# Altium schematic sheet FOTA MicroController Power Switch.SchDoc: FOTA MicroController Latched Power Trigger
size A4; DocumentNumber: 44; SheetNumber: 44; SheetTotal: 54
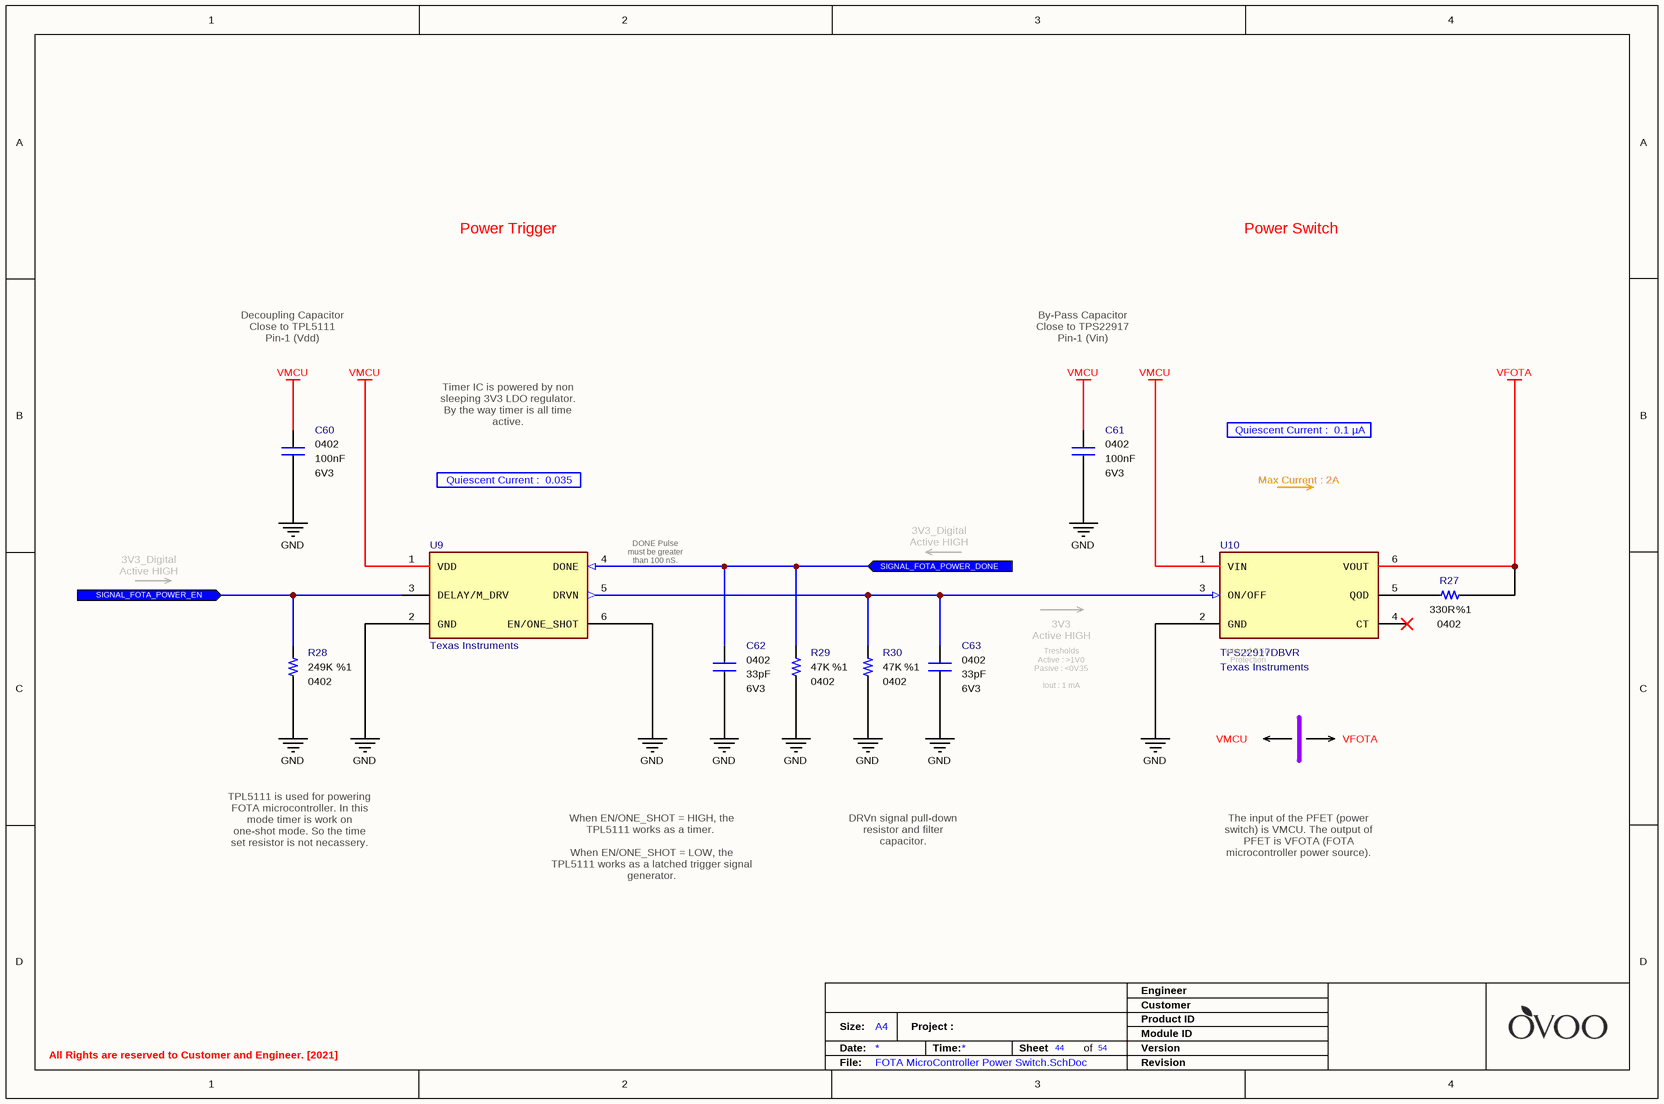
[diagram p0: FOTA MicroController Power Switch.SchDoc]

## Parts
C60  value 100nF  Case: 0402  Voltage: 6V3  [CAPACITOR_0402]  (hidden comment: Multilayer Ceramic Capacitor)
C61  value 100nF  Case: 0402  Voltage: 6V3  [CAPACITOR_0402]  (hidden comment: Multilayer Ceramic Capacitor)
C62  value 33pF  Case: 0402  Voltage: 6V3  [CAPACITOR_0402]  (hidden comment: Multilayer Ceramic Capacitor)
C63  value 33pF  Case: 0402  Voltage: 6V3  [CAPACITOR_0402]  (hidden comment: Multilayer Ceramic Capacitor)
R27  value 330R  Tolerance: %1  Case: 0402  [RESISTOR_0402]  (hidden comment: Thick Film Resistor)
R28  value 249K  Tolerance: %1  Case: 0402  [RESISTOR_0402]  (hidden comment: Thick Film Resistor)
R29  value 47K  Tolerance: %1  Case: 0402  [RESISTOR_0402]  (hidden comment: Thick Film Resistor)
R30  value 47K  Tolerance: %1  Case: 0402  [RESISTOR_0402]  (hidden comment: Thick Film Resistor)
U9  Manufacturer Name: Texas Instruments  [SOT-23-6]  (hidden comment: Nanopower Timer IC)
U10  Manufacturer Part Number: TPS22917DBVR  Manufacturer Name: Texas Instruments  [SOT-23-6]  (hidden comment: Power Switch)

## Ports
SIGNAL_FOTA_POWER_DONE (in), SIGNAL_FOTA_POWER_EN (in)

## Nets
GND: C60.1 C61.2 C62.1 C63.1 R28.1 R29.1 R30.1 U9.2(GND) U9.6(EN/ONE_SHOT) U10.2(GND)
VFOTA: R27.1 U10.6(VOUT)
VMCU: C60.2 C61.1 U9.1(VDD) U10.1(VIN)
SIGNAL_FOTA_POWER_DONE: C62.2 R29.2 U9.4(DONE) ; port SIGNAL_FOTA_POWER_DONE
SIGNAL_FOTA_POWER_EN: R28.2 U9.3(DELAY/M_DRV) ; port SIGNAL_FOTA_POWER_EN
NetC63_2: C63.2 R30.2 U9.5(DRVN) U10.3(ON/OFF)
NetR27_2: R27.2 U10.5(QOD)

Not connected (* = marked no-connect by the designer): U10 4(CT)*

## Notes on the sheet
- Power Trigger
- Power Switch
- Decoupling Capacitor
  Close to TPL5111
  Pin-1 (Vdd)
- By-Pass Capacitor
  Close to TPS22917
  Pin-1 (Vin)
- Timer IC is powered by non sleeping 3V3 LDO regulator. By the way timer is all time active.
- Quiescent Current :  0.1 µA
- Quiescent Current :  0.035 µA
- 3V3_Digital
  Active HIGH
- Max Current : 2A
- (near U9) DONE Pulse must be greater than 100 nS.
- Tresholds
  Active : >1V0
  Pasive : <0V35
  Iout : 1 mA
- 3V3
  Active HIGH
- (near U10) Internal ESD Protection
- VMCU
- VFOTA
- DRVn signal pull-down resistor and filter capacitor.
- TPL5111 is used for powering FOTA microcontroller. In this mode timer is work on one-shot mode. So the time set resistor is not necassery.
- When EN/ONE_SHOT = HIGH, the TPL5111 works as a timer.
  When EN/ONE_SHOT = LOW, the TPL5111 works as a latched trigger signal generator.
- The input of the PFET (power switch) is VMCU. The output of PFET is VFOTA (FOTA microcontroller power source).
- Engineer
- All Rights are reserved to Customer and Engineer. [2021]
- Size:
- Date:
- A4
- Project :
- Time:
- Sheet
- of
- Customer
- Product ID
- Module ID
- Version
- File:
- Revision

## Library data of the parts
C60 C61 = Capacitor - 100nF [0402-6V3]: Capacitor - 100nF [0402-6V3] (Ceramic); Manufacturer Name: AVX; Manufacturer Part Number: 04026D104KAT4A; Dielectric: X5R; Tolerance: %10; Height: 0.25mm; ComponentLink1Description: Mouser; ComponentLink1URL: https://www.mouser.com.tr/ProductDetail/AVX/04026D104KAT4A?qs=sGAEpiMZZMs0AnBnWHyRQPg4iYkCw7IMED%2F4kpqgf7w%3D; ComponentLink2Description: DataSheet; ComponentLink2URL: https://www.mouser.com.tr/datasheet/2/40/cx5r-776519.pdf; ROHS: Yes; Maximum Operating Temperature: +85; Minimum Operating Temperature: -55; Supplier 1: Avnet; Supplier Part Number 1: 04026D104KAT4A; Mouser Part Number: 581-04026D104KAT4A
C62 C63 = Capacitor - 33pF [0402-6V3]: Capacitor - 33pF [0402] (Ceramic); Manufacturer Name: Kemet; Manufacturer Part Number: C0402C330J9RACAUTO; Dielectric: X7R; Tolerance: 10%; Height: 0.5mm; Maximum Operating Temperature: +125; Minimum Operating Temperature: -55; ROHS: Yes; ComponentLink1Description: DataSheet; ComponentLink1URL: https://api.kemet.com/component-edge/download/datasheet/C0402C330J9RACAUTO.pdf; ComponentLink2Description: Mouser; ComponentLink2URL: https://www.mouser.com/Search/Refine.aspx?Keyword=80-C0402C330J9RAUTO; Supplier 1: Mouser; Supplier Part Number 1: 80-C0402C330J9RAUTO; Mouser Part Number: 80-C0402C330J9RAUTO
R27 = Resistor - 330R: Thick Film Resistors - SMD 1/16 W 330 Ohm 1%; Manufacturer Name: Vishay; Manufacturer Part Number: CRCW0402330RFKED; Height: 0.4mm; ComponentLink1Description: DataSheet; ComponentLink1URL: https://www.mouser.com.tr/datasheet/2/427/dcrcwe3-1762152.pdf; ComponentLink2Description: Mouser; ComponentLink2URL: https://www.mouser.com.tr/ProductDetail/Vishay-Dale/CRCW0402330RFKED?qs=sGAEpiMZZMu61qfTUdNhG2DpbjADlD3GGS6SwBlLi5Q%3D; Supplier 1: Mouser; Supplier 2: Digi-Key; Supplier Part Number 2: 541-330LCT-ND; Supplier Part Number 1: 71-CRCW0402-330-E3; Mouser Part Number: 71-CRCW0402-330-E3
R28 = Resistor - 249K: Thick Film Resistors - SMD 1/16 W 249 Kohms 1%; Manufacturer Name: Vishay; Manufacturer Part Number: CRCW0402249KFKED; Height: 0.35mm; ComponentLink1Description: DataSheet; ComponentLink1URL: https://www.mouser.com.tr/datasheet/2/427/dcrcwe3-1762152.pdf; ComponentLink2Description: Mouser; ComponentLink2URL: https://www.mouser.com.tr/ProductDetail/Vishay-Dale/CRCW0402249KFKED?qs=sGAEpiMZZMu61qfTUdNhG2DpbjADlD3GEiYBObatoAI%3D; Supplier 1: Mouser; Supplier 2: Digi-Key; Supplier Part Number 1: 71-CRCW0402-249K-E3; Supplier Part Number 2: 541-249KLCT-ND; Mouser Part Number: 71-CRCW0402-249K-E3
R29 R30 = Resistor - 47K: Thick Film Resistors - SMD 1/16 W 47 Kohms 1%; Manufacturer Name: Vishay; Manufacturer Part Number: CRCW040247K0FKED; Height: 0.4mm; ComponentLink1Description: DataSheet; ComponentLink1URL: https://www.mouser.com.tr/datasheet/2/427/dcrcwe3-1762152.pdf; ComponentLink2Description: Mouser; ComponentLink2URL: https://www.mouser.com.tr/ProductDetail/Vishay-Dale/CRCW040247K0FKED?qs=sGAEpiMZZMu61qfTUdNhG2DpbjADlD3GL%252B3h1elTxqU%3D; Supplier 1: Mouser; Supplier 2: Digi-Key; Supplier Part Number 1: 71-CRCW040247K0FKEDH; Supplier Part Number 2: 541-47.0KYCT-ND; Mouser Part Number: 71-CRCW0402-47K-E3
U9 = IC - TPL5111: Timers & Support Products Ultra Low Power System Timer (35 nA) for Power Gating in duty cycled applications.; Manufacturer Part Number: TPL5111DDCT; Supply Voltage - Min: 1.8V; Supply Voltage - Max: 5.5V; Height: 1.1mm; ROHS: Yes; Minimum Operating Temperature: -40; Maximum Operating Temperature: +105; ComponentLink1Description: DataSheet; ComponentLink1URL: http://www.ti.com/general/docs/suppproductinfo.tsp?distId=26&gotoUrl=http%3A%2F%2Fwww.ti.com%2Flit%2Fgpn%2Ftpl5111; ComponentLink2Description: Mouser; ComponentLink2URL: https://www.mouser.com/Search/Refine.aspx?Keyword=595-TPL5111DDCT; Supplier 1: Mouser; Supplier 2: Arrow; Supplier 3: Farnell; Supplier 4: Digi-Key; Supplier 5: Newark; Supplier Part Number 1: 595-TPL5111DDCT; Supplier Part Number 2: TPL5111DDCT; Supplier Part Number 3: 3006922; Supplier Part Number 4: 296-42621-1-ND; Supplier Part Number 5: 28AH5709; Mouser Part Number: 595-TPL5111DDCT; Case: SOT-23-6
U10 = IC - TPS22917DBVR: Power Switch MosFet; Height: 1.45mm; ComponentLink1Description: DataSheet; ComponentLink1URL: http://www.ti.com/lit/gpn/tps22917; ComponentLink2Description: Mouser; ComponentLink2URL: https://www.mouser.com/Search/Refine.aspx?Keyword=595-TPS22917DBVR; Supplier 1: Mouser; Supplier 2: Digi-Key; Supplier Part Number 1: 595-TPS22917DBVR; Supplier Part Number 2: 296-50498-1-ND; Mouser Part Number: 595-TPS22917DBVR; Case: SOT-23-6